# EAGLE design trb-1_v1.1 (EAGLE 7.4.0)
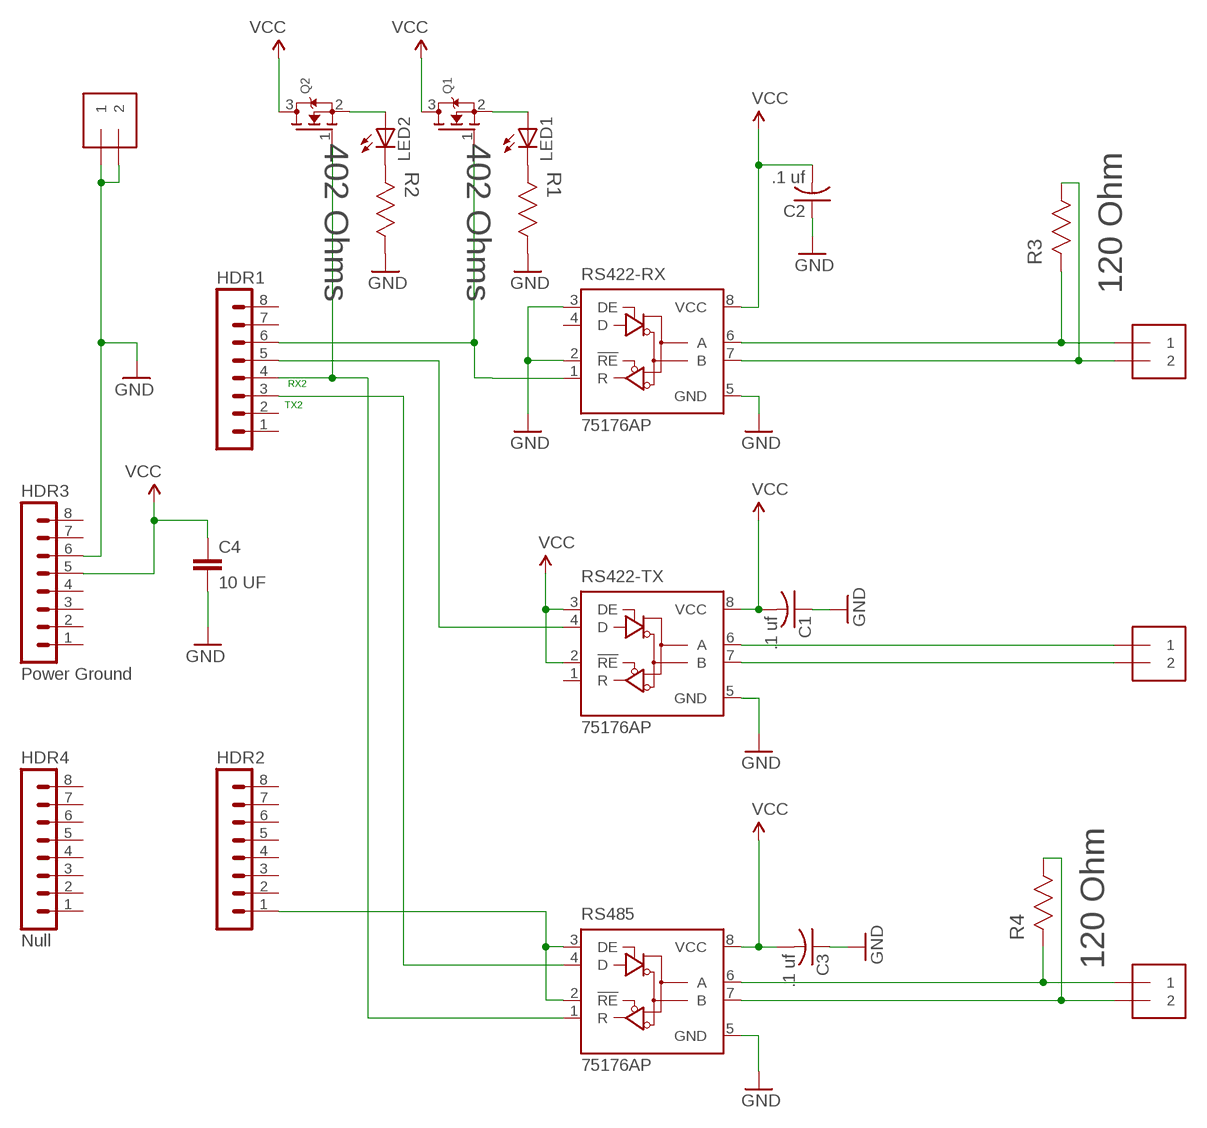
[diagram p0: schematic, sheet 1]

## Parts
C1  .1 uf  C-USC0805  [C0805]
C2  .1 uf  C-USC0805  [C0805]
C3  .1 uf  C-USC0805  [C0805]
C4  10 UF  10UF10V10%(0805)  [0805-CAP]
HDR1  MA08-1  [MA08-1]
HDR2  MA08-1  [MA08-1]
HDR3  Power Ground  MA08-1  [MA08-1]
HDR4  Null  MA08-1  [MA08-1]
J1  1X2-3.5MM  [1X2-3.5MM]
LED1  LEDCHIP-LED0805  [CHIP-LED0805]
LED2  LEDCHIP-LED0805  [CHIP-LED0805]
Q1  MOSFET-NREFLOW  [SOT23]
Q2  MOSFET-NREFLOW  [SOT23]
R1  402 Ohms  MCR10EZHF4020  [RESC2013X65N]
R2  402 Ohms  MCR10EZHF4020  [RESC2013X65N]
R3  120 Ohm  ERJ-6GEYJ121V  [RESC2013X65N]
R4  120 Ohm  ERJ-6GEYJ121V  [RESC2013X65N]
RS422-RX  75176AP  [DIL08]
RS422-RX1  1X2-3.5MM  [1X2-3.5MM]
RS422-TX  75176AP  [DIL08]
RS422-TX1  1X2-3.5MM  [1X2-3.5MM]
RS485  75176AP  [DIL08]
RS485-TXRX  1X2-3.5MM  [1X2-3.5MM]

## Nets
GND: C1.1 C2.1 C3.1 C4.2 HDR3.6 J1.1 J1.2 R1.1(R1) R2.1(R1) RS422-RX.2(!RE) RS422-RX.3(DE) RS422-RX.5(GND) RS422-TX.5(GND) RS485.5(GND)
N$1: HDR1.4 Q2.1(G) RS485.1(R)
N$2: HDR1.3 RS485.4(D)
N$3: HDR1.5 RS422-TX.4(D)
N$4: HDR1.6 Q1.1(G) RS422-RX.1(R)
N$5: HDR2.1 RS485.2(!RE) RS485.3(DE)
N$6: R3.2(R2) RS422-RX1.1 RS422-RX.6(A)
N$7: R3.1(R1) RS422-RX1.2 RS422-RX.7(B)
N$8: RS422-TX1.1 RS422-TX.6(A)
N$9: RS422-TX1.2 RS422-TX.7(B)
N$10: R4.2(R2) RS485-TXRX.1 RS485.6(A)
N$11: R4.1(R1) RS485-TXRX.2 RS485.7(B)
N$12: LED1.C R1.2(R2)
N$14: LED2.A Q2.2(S)
N$15: LED1.A Q1.2(S)
N$16: LED2.C R2.2(R2)
VCC: C1.2 C2.2 C3.2 C4.1 HDR3.5 Q1.3(D) Q2.3(D) RS422-RX.8(VCC) RS422-TX.2(!RE) RS422-TX.3(DE) RS422-TX.8(VCC) RS485.8(VCC)
Unconnected: HDR1.1 HDR1.2 HDR1.7 HDR1.8 HDR2.2 HDR2.3 HDR2.4 HDR2.5 HDR2.6 HDR2.7 HDR2.8 HDR3.1 HDR3.2 HDR3.3 HDR3.4 HDR3.7 HDR3.8 HDR4.1 HDR4.2 HDR4.3 HDR4.4 HDR4.5 HDR4.6 HDR4.7 HDR4.8 RS422-RX.4(D) RS422-TX.1(R)

## Notes on the sheet
- RX2
- TX2

## Library data of the parts
C1-C3 = resistor:C-US: CAPACITOR, American symbol
C4 = SparkFun-Capacitors:10UF10V10%(0805): CAP-11330; PROD_ID: CAP-11330
HDR1-HDR4 = con-lstb:MA08-1: PIN HEADER; OC_FARNELL: unknown; OC_NEWARK: unknown
J1 RS422-RX1 RS422-TX1 RS485-TXRX = adafruit:1X2: 3.5mm Terminal block http://www.ladyada.net/library/pcb/eaglelibrary.html
LED1 LED2 = adafruit:LED: LED OSRAM: - CHIPLED LG R971, LG N971, LY N971, LG Q971, LY Q971, LO R971, LY R971 LH N974, LH R974 LS Q976, LO Q976, LY Q976 LO Q996 - Hyper CHIPLED LW Q18S LB Q993, LB Q99A, LB R99A - SideLED LS A670, LO A670, LY A670, LG A670, LP A670 LB A673, LV A673, LT A673, LW A673 LH A674 LY A675 LS A676, LA A676, LO A676, LY A676, LW A676 LS A679, LY A679, LG A679 - Hyper Micro SIDELED® LS Y876, LA Y876, LO Y876, LY Y876 LT Y87S - SmartLED LW L88C, LW L88S LB L89C, LB L89S, LG L890 LS L89K, LO L89K, LY L89K LS L896, LA L896, LO L896, LY L896 - TOPLED LS T670, LO T670, LY T670, LG T670, LP T670 LSG T670, LSP T670, LSY T670, LOP T670, LYG T670 LG T671, LOG T671, LSG T671 LB T673, LV T673, LT T673, LW T673 LH T674 LS T676, LA T676, LO T676, LY T676, LB T676, LH T676, LSB T676, LW T676 LB T67C, LV T67C, LT T67C, LS T67K, LO T67K, LY T67K, LW E67C LS E67B, LA E67B, LO E67B, LY E67B, LB E67C, LV E67C, LT E67C LW T67C LS T679, LY T679, LG T679 LS T770, LO T770, LY T770, LG T770, LP T770 LB T773, LV T773, LT T773, LW T773 LH T774 LS E675, LA E675, LY E675, LS T675 LS T776, LA T776, LO T776, LY T776, LB T776 LHGB T686 LT T68C, LB T68C - Hyper Mini TOPLED® LB M676 - Mini TOPLED Santana® LG M470 LS M47K, LO M47K, LY M47K Source: http://www.osram.convergy.de/
Q1 Q2 = adafruit:MOSFET-N: N-Channel Mosfet 2N7002E - 60V 260mA SOT23 [Digikey: 2N7002ET1GOSTR-ND] - REEL BSH103 - 30V 850mA SOT23 [Digikey: 568-5013-1-ND]
R1 R2 = ROHM_By_element14_Batch_1:MCR10EZHF4020: RESISTOR, 0805; MPN: MCR10EZHF4020; OC_FARNELL: -; OC_NEWARK: 08N6025; SUPPLIER: ROHM; TOLERANCE: ±1%; WATTAGE: 1/8 W
R3 R4 = Panasonic_By_element14_Batch_1:ERJ-6GEYJ121V: RESISTOR, 0805; MPN: ERJ-6GEYJ121V; OC_FARNELL: -; OC_NEWARK: 52R2563; SUPPLIER: Panasonic; TOLERANCE: ±5%; WATTAGE: 0.125 W
RS422-RX RS422-TX RS485 = 751xx:75176A: DIFFERENTIAL BUS TRANSCEIVER Source: http://focus.ti.com/lit/ds/symlink/sn75176a.pdf; MF: TEXAS INSTRUMENTS; MPN: SN75176AP; OC_NEWARK: 08F8125

## Net classes
0 default: width 0.305 mm, drill 0.508 mm, clearance 0.305 mm

## Board
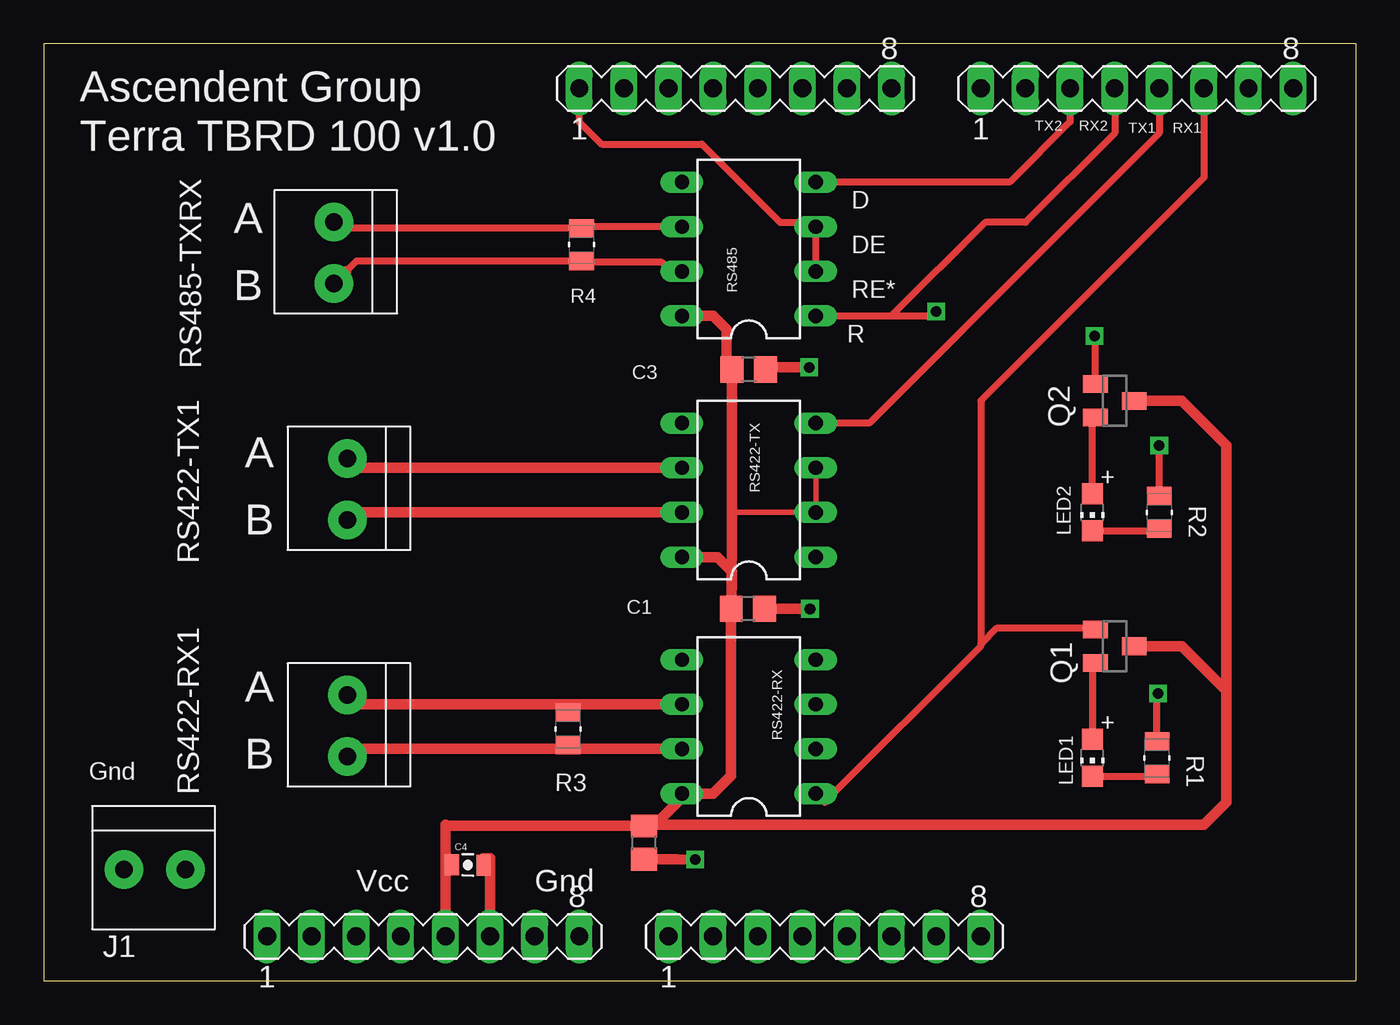
[diagram p1: board, top side]
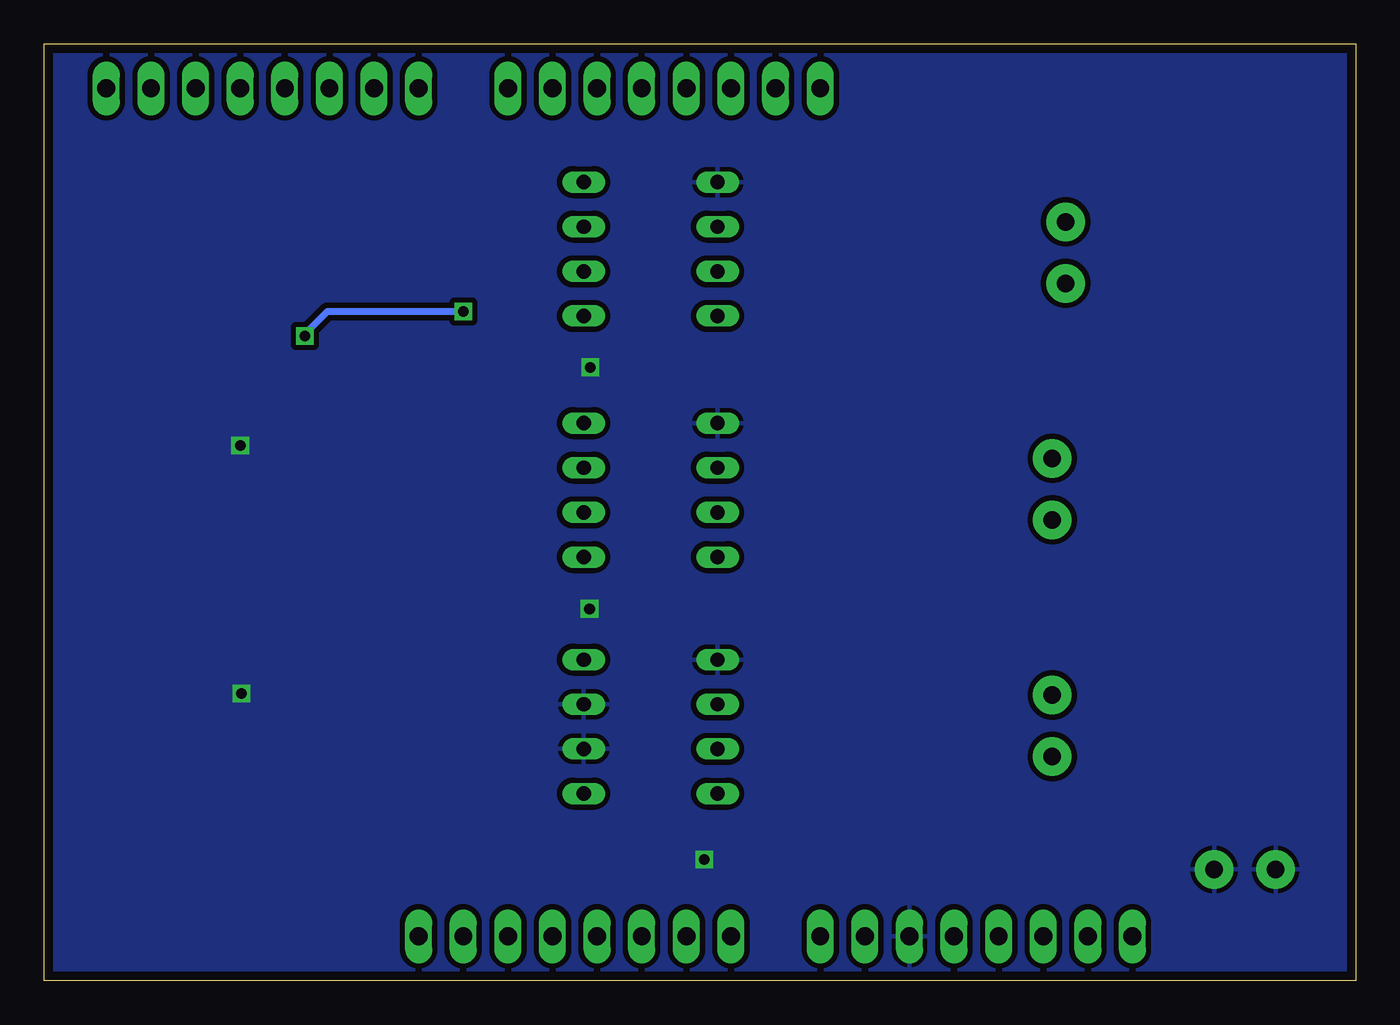
[diagram p2: board, bottom side, seen from below]

Size 74.68 x 53.33 mm. Coordinates in mm from the lower left corner, seen from the top.
Outline: 0,0 74.68,0 74.68,53.33 0,53.33 0,0
Copper layers (1*16): Top 0.0178mm / dielectric 59mil / Bottom 0.0178mm
Design rules "SSC-EAGLE-2Lyr_v1.0.0.3": minimum track width 6mil, minimum drill 14mil, track to track 6mil, track to pad 6mil, pad to pad 6mil, via to via 6mil, smd to smd 6mil, copper to edge 20mil, drill to drill 16mil, minimum pad ring 8mil, minimum via ring 8mil, stop-mask expansion 3mil, vias tented up to drill 0mil, thermal gap 10mil

### Footprints (pad centres in the part's own frame; a part is rotated, then mirrored left to right if it is on the bottom)
C0805 = smd 1.3 x 1.5: 1 -0.95,0; 2 0.95,0
0805-CAP = smd 0.8 x 1.2: 1 -0.9,0; 2 0.9,0
MA08-1 = drill 1.016 long: 1 -8.89,0; 2 -6.35,0; 3 -3.81,0; 4 -1.27,0; 5 1.27,0; 6 3.81,0; 7 6.35,0; 8 8.89,0
1X2-3.5MM = drill 1 pad 2.184: 1 1.8,0; 2 -1.7,0
CHIP-LED0805 = smd 1.2 x 1.2: A 0,-1.05; C 0,1.05
SOT23 = smd 1 x 1.4: 1 -0.95,-1.1; 2 0.95,-1.1; 3 0,1.1
RESC2013X65N = smd 1.016 x 1.397: 1 -0.94,0; 2 0.94,0
DIL08 = drill 0.813 long: 1 -3.81,-3.81; 2 -1.27,-3.81; 3 1.27,-3.81; 4 3.81,-3.81; 5 3.81,3.81; 6 1.27,3.81; 7 -1.27,3.81; 8 -3.81,3.81

### Placement (x,y rotation side)
C1  40.08,21.18 180 top
C2  34.16,7.87 90 top
C3  40.13,34.8 180 top
C4  24.13,6.6 359.4 top
HDR1  62.23,50.8 0 top
HDR2  39.37,50.8 0 top
HDR3  21.59,2.54 0 top
HDR4  44.45,2.54 0 top
J1  6.35,6.35 180 top
LED1  59.69,12.7 180 top
LED2  59.69,26.67 180 top
Q1  60.96,19.05 270 top
Q2  60.96,33.02 270 top
R1  63.37,12.7 270 top
R2  63.5,26.67 270 top
R3  29.84,14.35 90 top
R4  30.61,41.91 90 top
RS422-RX  40.13,14.48 90 top
RS422-RX1  17.27,14.48 90 top
RS422-TX  40.13,27.94 90 top
RS422-TX1  17.27,27.94 90 top
RS485  40.13,41.66 90 top
RS485-TXRX  16.51,41.4 90 top

### Tracks (layer width: path | path; a pad name or v marks a point on that pad's centre or on a via)
GND  (via drill 0.6)
  Top 0.406: R2.1 v63.5,30.48 | R1.1 63.37,16.31 v63.42,16.36
  Top 0.61: C2.1 36.05,6.92 v37.08,6.91 | v43.61,21.18 C1.1 | HDR3.6 25.4,6.99 25.03,6.99 C4.2 | v43.56,34.92 41.08,34.92 C3.1
  pour Bottom (isolate 0.305): -1.27,54.61 -1.27,-2.54 77.47,-2.54 77.47,1.27 77.47,54.61
N$1  (via drill 0.6)
  Top 0.406: RS485.1 48.26,37.85 | 48.26,37.85 50.55,37.85 v50.8,38.1 | HDR1.4 60.96,48.26 55.88,43.18 53.59,43.18 48.26,37.85 | Q2.1 59.86,36.66 v59.82,36.7
  Bottom 0.406: v50.8,38.1 58.55,38.1 59.94,36.7 v59.82,36.7
N$2
  Top 0.406: HDR1.3 58.42,48.9 54.99,45.47 RS485.4
N$3
  Top 0.406: HDR1.5 63.5,48.26 46.99,31.75 RS422-TX.4
N$4
  Top 0.406: HDR1.6 66.04,45.72 53.34,33.02 53.34,19.18 | 53.34,19.18 53.34,19.05 44.45,10.16 RS422-RX.1 | Q1.1 59.79,20.07 54.23,20.07 53.34,19.18
N$5
  Top 0.406: HDR2.1 30.48,48.9 31.75,47.62 37.47,47.62 41.91,43.18 43.69,43.18 RS485.3 RS485.2
N$6
  Top 0.406: RS422-RX.6 30.3,15.75 R3.2
  Top 0.61: RS422-RX.6 17.8,15.75 RS422-RX1.1
N$7
  Top 0.406: RS422-RX.7 30.05,13.21 R3.1
  Top 0.61: RS422-RX.7 17.7,13.21 RS422-RX1.2
N$8
  Top 0.61: RS422-TX.6 17.8,29.21 RS422-TX1.1
N$9
  Top 0.61: RS422-TX.7 17.7,26.67 RS422-TX1.2
N$10
  Top 0.406: RS485.6 30.68,42.93 R4.2 16.86,42.85 RS485-TXRX.1
  Top 0.61: 16.79,42.93 RS485-TXRX.1
N$11
  Top 0.406: 16.98,40.17 17.78,40.97 R4.1 30.68,40.89 35.18,40.89 35.69,40.39 RS485.7
  Top 0.61: 17.19,40.39 16.98,40.17 RS485-TXRX.2
N$12
  Top 0.406: LED1.C 63.26,11.65 R1.2
N$14
  Top 0.406: LED2.A 59.69,31.9 Q2.2
N$15
  Top 0.406: Q1.2 59.86,17.95 59.69,17.78 LED1.A
N$16
  Top 0.406: LED2.C 63.39,25.62 R2.2
VCC
  Top 0.305: 39.18,26.67 RS422-TX.2 RS422-TX.3
  Top 0.61: 34.29,8.82 C2.2 22.93,8.82 22.86,8.89 22.86,6.61 | 34.29,8.82 34.73,8.82 36.07,10.16 36.07,10.41 RS422-RX.8 38.1,10.67 39.12,11.68 39.12,21.02 C1.2 | C1.2 39.18,23.3 38.35,24.13 RS422-TX.8 | C1.2 39.18,26.67 39.18,34.48 38.86,34.8 | 38.86,34.8 38.86,37.08 38.1,37.85 RS485.8 | 38.86,34.8 C3.2 | HDR3.5 22.86,6.61 | C4.1 22.86,6.61 | 67.31,16.51 67.31,10.16 66.04,8.89 34.36,8.89 34.29,8.82 | 67.31,16.51 67.31,30.48 64.77,33.02 Q2.3 | Q1.3 64.77,19.05 67.31,16.51
  Bottom 0.813: HDR3.5 22.86,2.29

### Text on the board
tPlace: Ascendent Group | TX2 | RX2 | TX1 | RX1 | Terra TBRD 100 v1.0 | D | A | DE | B | RE* | R | A | B | A | B | Gnd | Vcc | Gnd